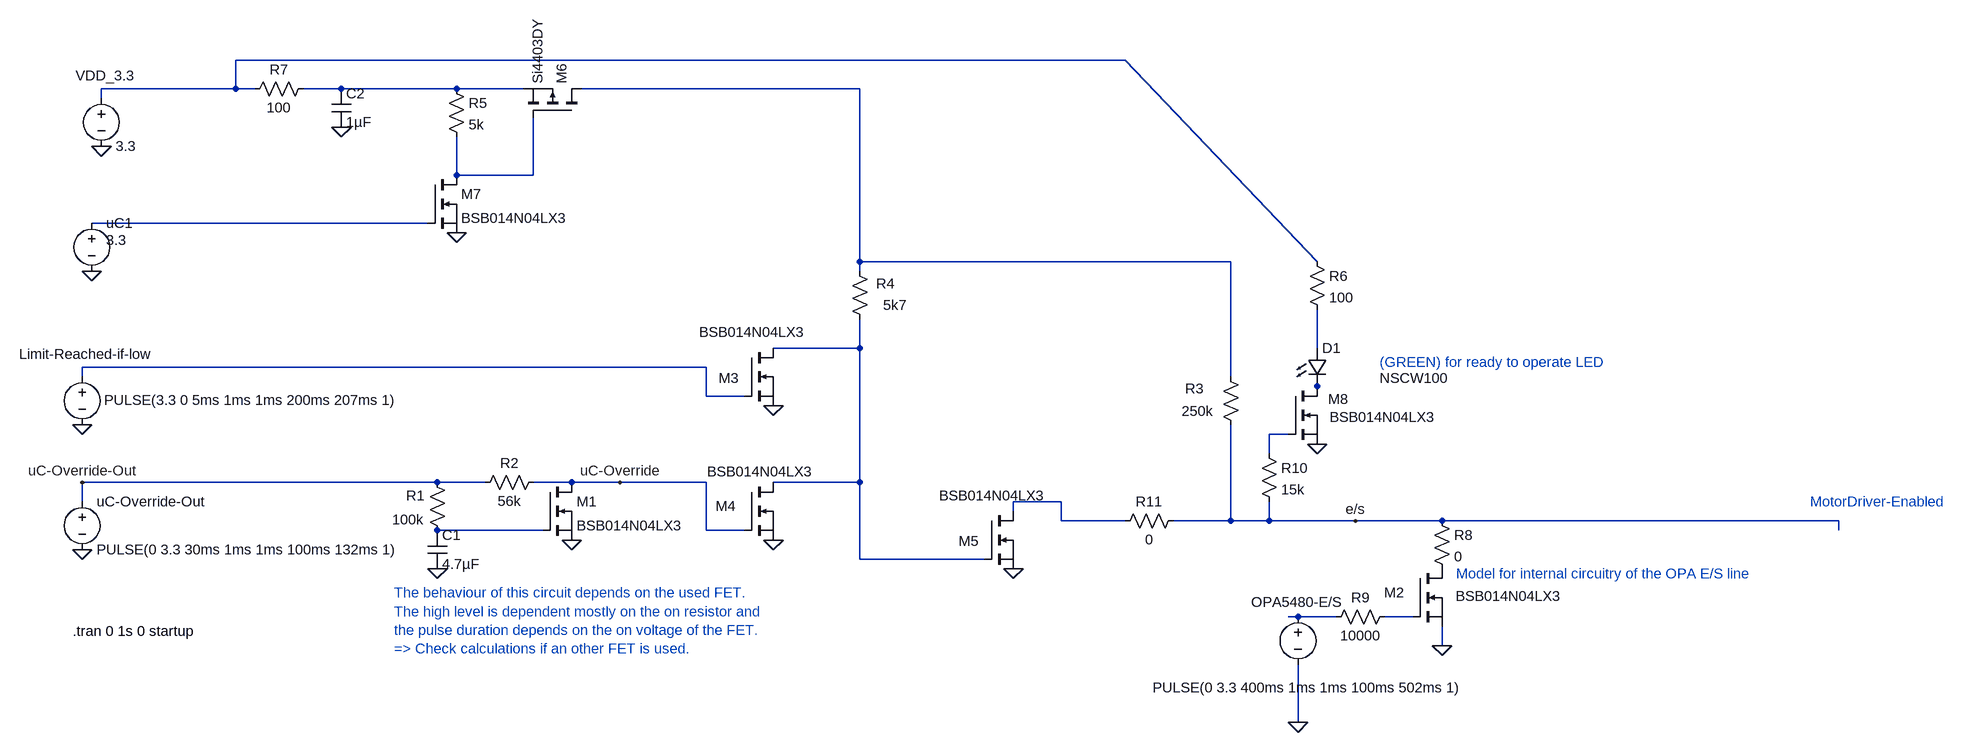
[diagram p0: schematic LimitSwitchOverrider-V0.2.asc]
LimitSwitchOverrider-V0.2.asc, the LTspice schematic file:
Version 4
SHEET 1 3236 1280
WIRE 1040 -640 -464 -640
WIRE -464 -592 -464 -640
WIRE -464 -592 -688 -592
WIRE -432 -592 -464 -592
WIRE -288 -592 -352 -592
WIRE -96 -592 -288 -592
WIRE 16 -592 -96 -592
WIRE 576 -592 112 -592
WIRE -688 -576 -688 -592
WIRE -96 -448 -96 -512
WIRE 32 -448 32 -544
WIRE 32 -448 -96 -448
WIRE -144 -368 -704 -368
WIRE 576 -304 576 -592
WIRE 1216 -304 576 -304
WIRE 1360 -304 1040 -640
WIRE 576 -288 576 -304
WIRE 576 -160 576 -208
WIRE 576 -160 432 -160
WIRE 1360 -160 1360 -224
WIRE 320 -128 -720 -128
WIRE -720 -112 -720 -128
WIRE 1216 -112 1216 -304
WIRE 320 -80 320 -128
WIRE 384 -80 320 -80
WIRE 1360 -80 1360 -96
WIRE 1312 -16 1280 -16
WIRE 1280 16 1280 -16
WIRE -128 64 -720 64
WIRE -48 64 -128 64
WIRE 96 64 32 64
WIRE 176 64 96 64
WIRE 320 64 176 64
WIRE 576 64 576 -160
WIRE 576 64 432 64
WIRE -720 96 -720 64
WIRE 912 96 832 96
WIRE 832 112 832 96
WIRE 912 128 912 96
WIRE 1040 128 912 128
WIRE 1216 128 1216 -32
WIRE 1216 128 1120 128
WIRE 1280 128 1280 96
WIRE 1280 128 1216 128
WIRE 1424 128 1280 128
WIRE 1568 128 1424 128
WIRE 2496 128 1568 128
WIRE 48 144 -128 144
WIRE 320 144 320 64
WIRE 384 144 320 144
WIRE 2496 144 2496 128
WIRE 576 192 576 64
WIRE 784 192 576 192
WIRE 1328 288 1312 288
WIRE 1392 288 1328 288
WIRE 1520 288 1472 288
WIRE 1568 336 1568 304
WIRE 1328 464 1328 368
FLAG -128 208 0
FLAG -720 176 0
FLAG 176 64 uC-Override
FLAG -720 64 uC-Override-Out
FLAG -720 -32 0
FLAG -688 -496 0
FLAG 96 160 0
FLAG 432 -64 0
FLAG 432 160 0
FLAG 1424 128 e/s
FLAG 1568 336 0
FLAG 1328 464 0
FLAG 832 208 0
FLAG -96 -352 0
FLAG -704 -288 0
FLAG -288 -528 0
FLAG 1360 0 0
SYMBOL res -144 48 R0
WINDOW 0 -36 38 Left 2
WINDOW 3 -59 78 Left 2
SYMATTR InstName R1
SYMATTR Value 100k
SYMBOL voltage -720 80 R0
WINDOW 123 0 0 Left 2
WINDOW 39 0 0 Left 2
SYMATTR InstName uC-Override-Out
SYMATTR Value PULSE(0 3.3 30ms 1ms 1ms 100ms 132ms 1)
SYMBOL cap -144 144 R0
SYMATTR InstName C1
SYMATTR Value 4.7µF
SYMBOL res 48 48 R90
WINDOW 0 0 56 VBottom 2
WINDOW 3 32 56 VTop 2
SYMATTR InstName R2
SYMATTR Value 56k
SYMBOL voltage -720 -128 R0
WINDOW 0 -105 -22 Left 2
WINDOW 3 37 55 Left 2
WINDOW 123 0 0 Left 2
WINDOW 39 0 0 Left 2
SYMATTR InstName Limit-Reached-if-low
SYMATTR Value PULSE(3.3 0 5ms 1ms 1ms 200ms 207ms 1)
SYMBOL voltage -688 -592 R0
WINDOW 0 -43 -22 Left 2
WINDOW 123 0 0 Left 2
WINDOW 39 0 0 Left 2
SYMATTR InstName VDD_3.3
SYMATTR Value 3.3
SYMBOL nmos 384 -160 R0
WINDOW 0 -43 50 Left 2
WINDOW 3 -76 -26 Left 2
SYMATTR InstName M3
SYMATTR Value BSB014N04LX3
SYMBOL res 592 -192 R180
WINDOW 0 -42 75 Left 2
WINDOW 3 -62 39 Left 2
SYMATTR InstName R4
SYMATTR Value 5k7
SYMBOL nmos 384 64 R0
WINDOW 0 -48 40 Left 2
WINDOW 3 -62 -18 Left 2
SYMATTR InstName M4
SYMATTR Value BSB014N04LX3
SYMBOL voltage 1328 272 R0
WINDOW 0 -78 -8 Left 2
WINDOW 3 -242 134 Left 2
WINDOW 123 0 0 Left 2
WINDOW 39 0 0 Left 2
SYMATTR InstName OPA5480-E/S
SYMATTR Value PULSE(0 3.3 400ms 1ms 1ms 100ms 502ms 1)
SYMBOL nmos 48 64 R0
SYMATTR InstName M1
SYMATTR Value BSB014N04LX3
SYMBOL res 1344 -320 R0
SYMATTR InstName R6
SYMATTR Value 100
SYMBOL LED 1344 -160 R0
WINDOW 3 120 50 Left 2
SYMATTR InstName D1
SYMATTR Value NSCW100
SYMBOL nmos 1520 208 R0
WINDOW 0 -48 40 Left 2
WINDOW 3 71 46 Left 2
SYMATTR InstName M2
SYMATTR Value BSB014N04LX3
SYMBOL nmos 784 112 R0
WINDOW 0 -43 50 Left 2
WINDOW 3 -76 -26 Left 2
SYMATTR InstName M5
SYMATTR Value BSB014N04LX3
SYMBOL res 1200 -128 R0
WINDOW 0 -60 36 Left 2
WINDOW 3 -66 73 Left 2
SYMATTR InstName R3
SYMATTR Value 250k
SYMBOL pmos 112 -544 M270
SYMATTR InstName M6
SYMATTR Value Si4403DY
SYMBOL res -112 -608 R0
SYMATTR InstName R5
SYMATTR Value 5k
SYMBOL voltage -704 -384 R0
WINDOW 123 0 0 Left 2
WINDOW 39 0 0 Left 2
WINDOW 3 24 44 Left 2
SYMATTR InstName uC1
SYMATTR Value 3.3
SYMBOL nmos -144 -448 R0
SYMATTR InstName M7
SYMATTR Value BSB014N04LX3
SYMBOL cap -304 -592 R0
SYMATTR InstName C2
SYMATTR Value 1µF
SYMBOL res -336 -608 R90
WINDOW 0 0 56 VBottom 2
WINDOW 3 32 56 VTop 2
SYMATTR InstName R7
SYMATTR Value 100
SYMBOL nmos 1312 -96 R0
WINDOW 0 66 21 Left 2
WINDOW 3 69 51 Left 2
SYMATTR InstName M8
SYMATTR Value BSB014N04LX3
SYMBOL res 1552 112 R0
SYMATTR InstName R8
SYMATTR Value 0
SYMBOL res 1488 272 R90
WINDOW 0 0 56 VBottom 2
WINDOW 3 32 56 VTop 2
SYMATTR InstName R9
SYMATTR Value 10000
SYMBOL res 1264 0 R0
SYMATTR InstName R10
SYMATTR Value 15k
SYMBOL res 1136 112 R90
WINDOW 0 0 56 VBottom 2
WINDOW 3 32 56 VTop 2
SYMATTR InstName R11
SYMATTR Value 0
TEXT -736 312 Left 2 !.tran 0 1s 0 startup
TEXT -200 248 Left 2 ;The behaviour of this circuit depends on the used FET.\nThe high level is dependent mostly on the on resistor and \nthe pulse duration depends on the on voltage of the FET.\n=> Check calculations if an other FET is used.
TEXT 1592 216 Left 2 ;Model for internal circuitry of the OPA E/S line
TEXT 1464 -136 Left 2 ;(GREEN) for ready to operate LED
TEXT 2448 96 Left 2 ;MotorDriver-Enabled

The netlist it stands for:
* LimitSwitchOverrider-V0.2.asc
R1 uC-Override-Out N012 100k
V§uC-Override-Out uC-Override-Out 0 PULSE(0 3.3 30ms 1ms 1ms 100ms 132ms 1)
C1 N012 0 4.7µF
R2 uC-Override uC-Override-Out 56k
V§Limit-Reached-if-low N008 0 PULSE(3.3 0 5ms 1ms 1ms 200ms 207ms 1)
VDD_3.3 N001 0 3.3
M3 N006 N008 0 0 BSB014N04LX3
R4 N006 N003 5k7
M4 N006 uC-Override 0 0 BSB014N04LX3
V§OPA5480-E/S N013 0 PULSE(0 3.3 400ms 1ms 1ms 100ms 502ms 1)
M1 uC-Override N012 0 0 BSB014N04LX3
R6 N001 N007 100
D1 N007 N009 NSCW100
M2 P001 N014 0 0 BSB014N04LX3
M5 N011 N006 0 0 BSB014N04LX3
R3 N003 e/s 250k
M6 N003 N004 N002 N002 Si4403DY
R5 N002 N004 5k
V§uC1 N005 0 3.3
M7 N004 N005 0 0 BSB014N04LX3
C2 N002 0 1µF
R7 N002 N001 100
M8 N009 N010 0 0 BSB014N04LX3
R8 e/s P001 0
R9 N014 N013 10000
R10 N010 e/s 15k
R11 e/s N011 0
.model D D
.lib standard.dio
.model NMOS NMOS
.model PMOS PMOS
.lib standard.mos
.tran 0 1s 0 startup
* The behaviour of this circuit depends on the used FET.
* The high level is dependent mostly on the on resistor and
* the pulse duration depends on the on voltage of the FET.
* => Check calculations if an other FET is used.
* Model for internal circuitry of the OPA E/S line
* (GREEN) for ready to operate LED
* MotorDriver-Enabled
.backanno
.end